# EasyEDA Pro project psu-5v-v101.eprj, schematic main-board
Board Name: main-board; Create Date: 2025-11-11; Page Name: P1; Project Name: psu-5v-v101; Schematic Name: main-board; Update Date: 2025-11-25; Company: EasyEDA.com; Page Size: A4; Version: V1.0
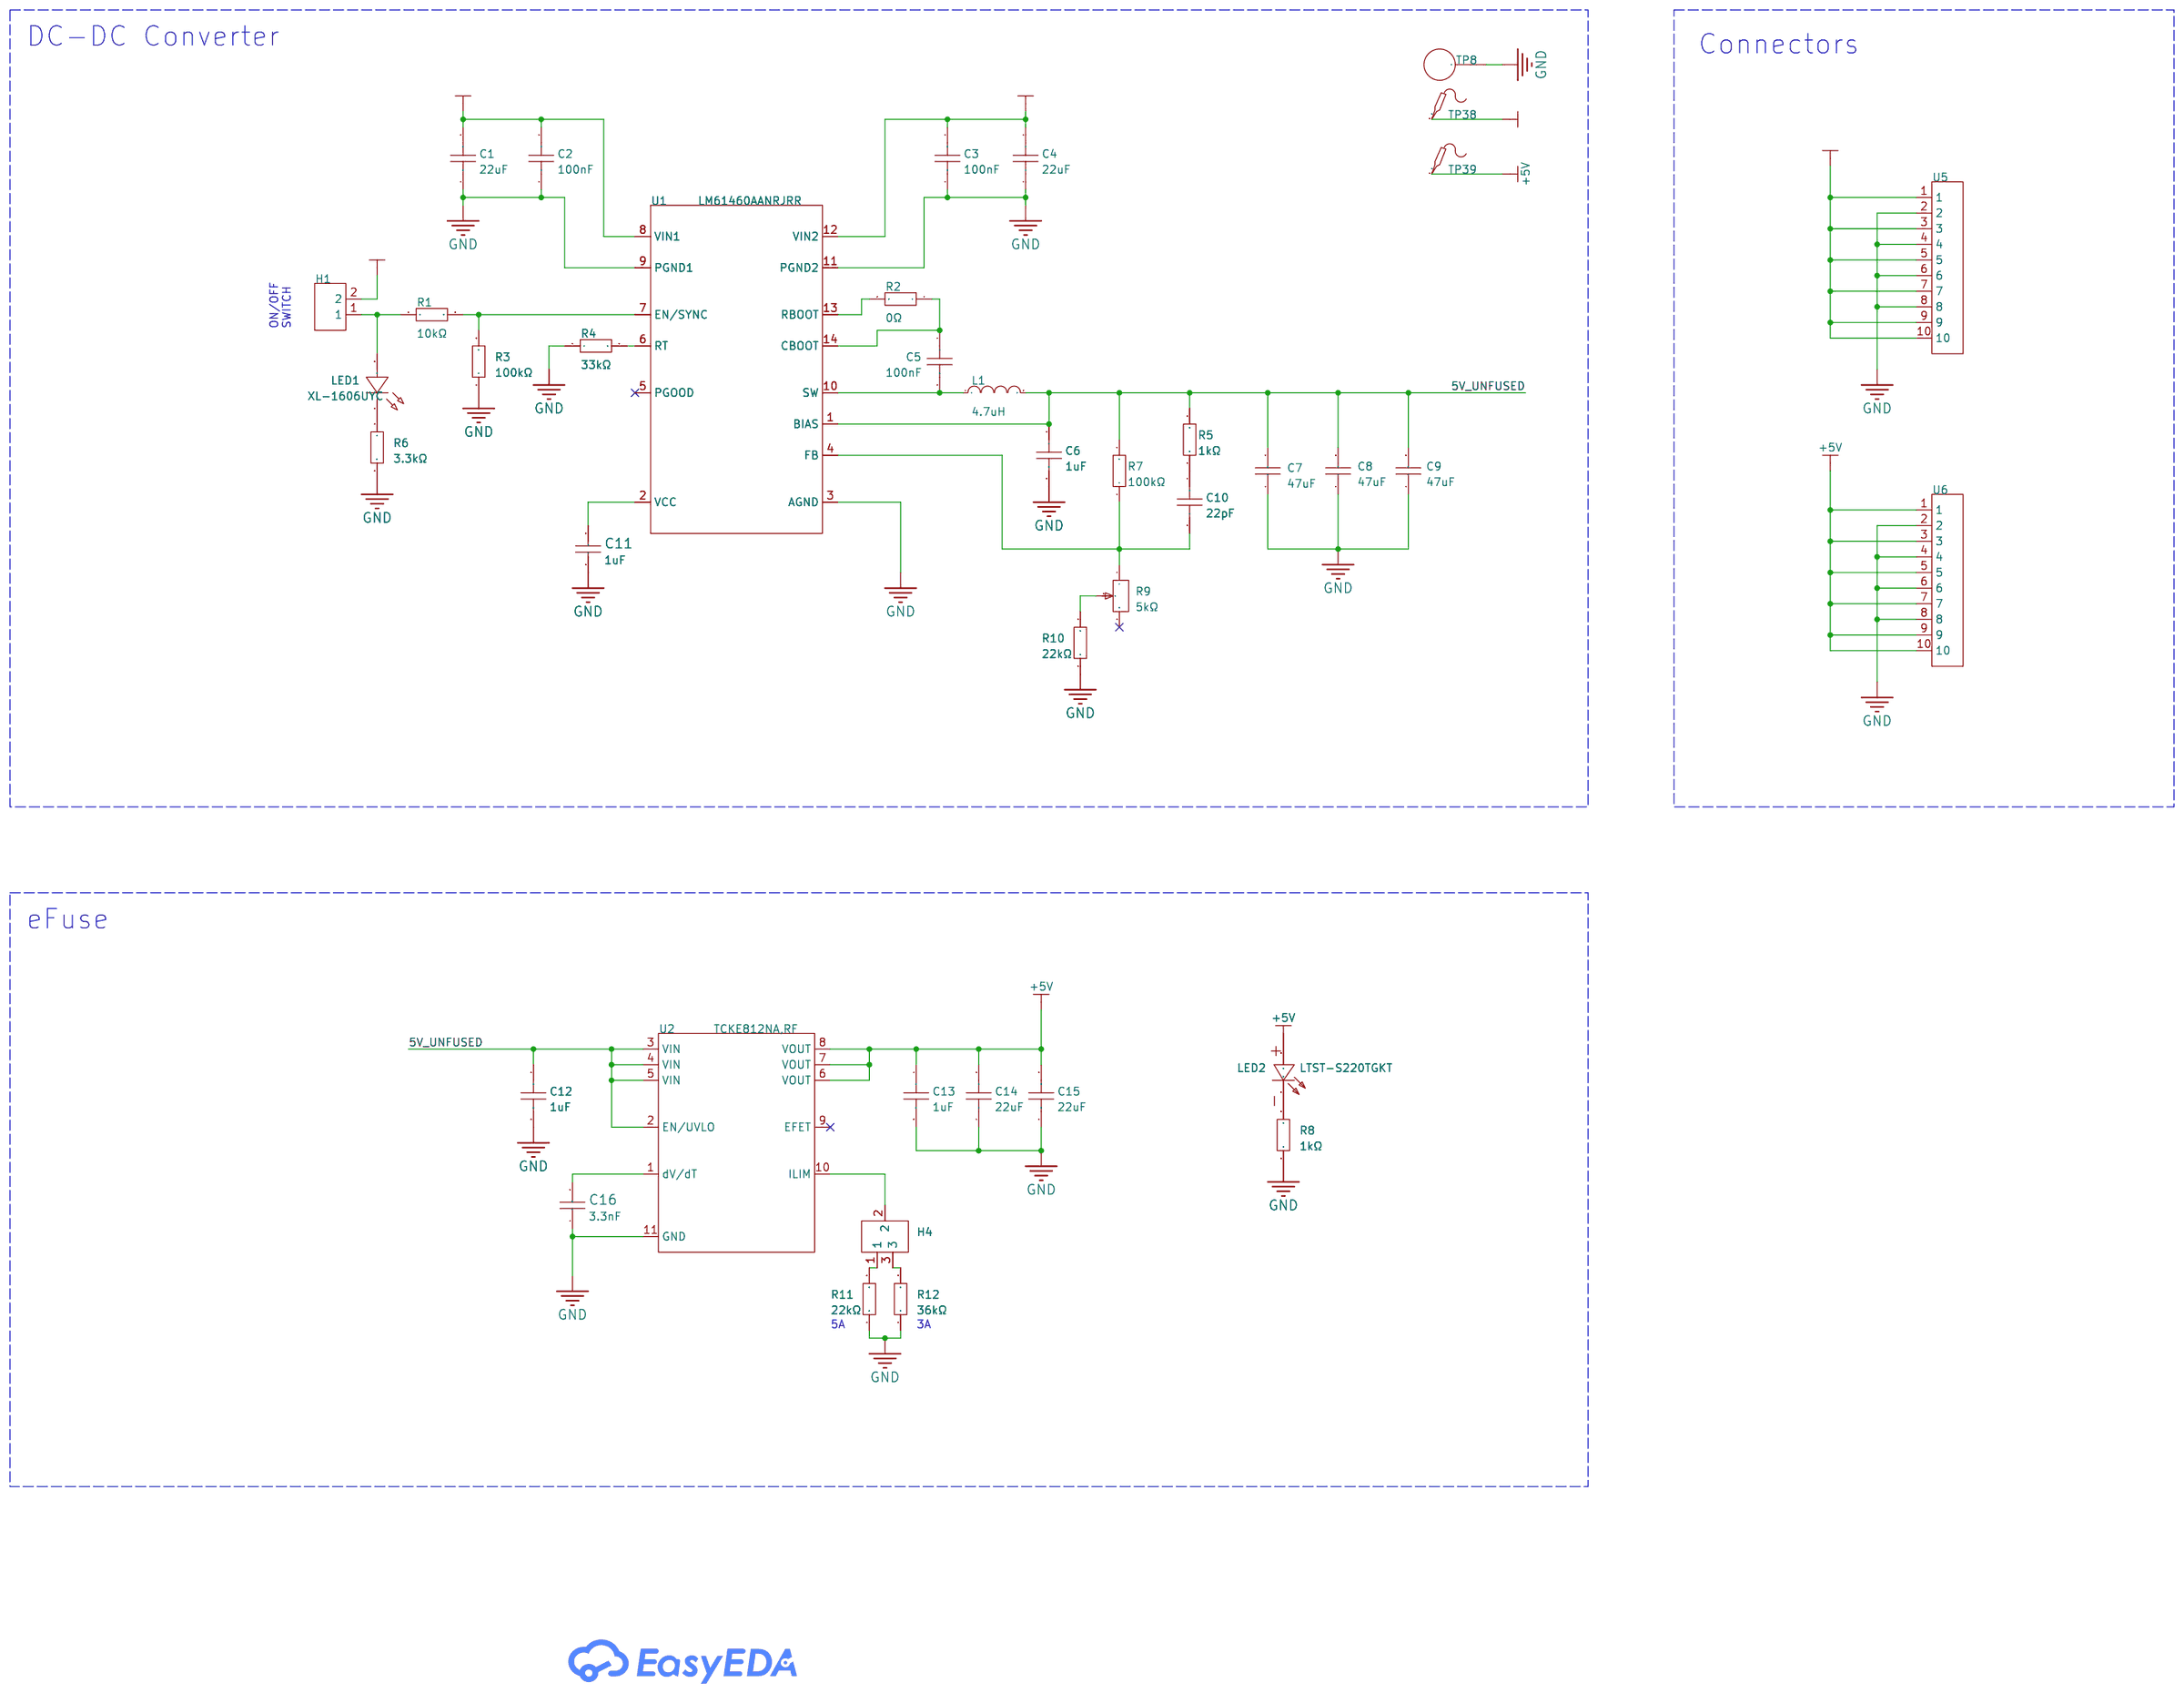
[diagram p2: schematic sheet]

## Parts
C1  22uF  [C2220]
C2  100nF  [C0603]
C3  100nF  [C0603]
C4  22uF  [C2220]
C5  100nF  [C0603]
C6  1uF  [C0805]
C7  47uF  [C1210]
C8  47uF  [C1210]
C9  47uF  [C1210]
C10  22pF  [C0603]
C11  1uF  [C0805]
C12  1uF  [C0805]
C13  1uF  [C0805]
C14  22uF  [C1206]
C15  22uF  [C1206]
C16  3.3nF  [C0603]
H1  PZ254V-11-02P  [HDR-TH_2P-P2.54-V-M]
H4  X6511WVS-03H-C60D48R2  [HDR-SMD_3P-P2.54_XKB_X6511WVS-03H-C60D48R2]
L1  4.7uH  [IND-SMD_L10.9-W10.0]
LED1  XL-1606UYC  [LED-SMD_L1.7-W1.1-RD_27-21]
LED2  LTST-S220TGKT  [LED-SMD_L2.2-W0.6-RD_GREEN]
R1  10kΩ  [R0603]
R2  0Ω  [R0603]
R3  100kΩ  [R0603]
R4  33kΩ  [R0603]
R5  1kΩ  [R0603]
R6  3.3kΩ  [R0603]
R7  100kΩ  [R0603]
R8  1kΩ  [R0603]
R9  5kΩ  [RES-ADJ-TH_3P-L6.6-W7.0-P2.54-L_3362P]
R10  22kΩ  [R0603]
R11  22kΩ  [R0603]
R12  36kΩ  [R0603]
TP8  RH-5004  [TESTPOINT_TH_BD2.5-D1.2]
TP38  -  [Test-Point-0.5mm]
TP39  -  [Test-Point-0.5mm]
U1  LM61460AANRJRR  [VQFN-HR-14_L4.0-W3.5-P0.50-TL_TI_RJR-1]
U2  TCKE812NA,RF  [VSON-10_L3.0-W3.0-P0.50-TL-EP]
U5  2541WR-10P  [HDR-TH_10P-P2.54-H-M-W10.4]
U6  2541WR-10P  [HDR-TH_10P-P2.54-H-M-W10.4]

## Library data of the parts
C1 C4 = FS55X226K500EHG: LCSC Part Name: 22uF ±10% 50V; Supplier Part: C784103; Manufacturer: PSA(信昌电陶); Supplier Footprint: 2220; JLCPCB Part Class: Extended Part; Datasheet: https://atta.szlcsc.com/upload/public/pdf/source/20190723/C381466_B1CCDB289216E7EE775C98769E222CFD.pdf; Supplier: LCSC; Tolerance: ±10%; Voltage Rating: 50V; Temperature Coefficient: X7R
C2 C3 C5 = CC0603KRX7R9BB104: Capacitance:100nF Tolerance:±10% Tolerance:±10% Voltage Rating:50V Temperature Coefficient:X7R; LCSC Part Name: 100nF ±10% 50V; Supplier Part: C14663; Manufacturer: YAGEO(国巨); Supplier Footprint: 0603; JLCPCB Part Class: Basic Part; Datasheet: https://item.szlcsc.com/datasheet/CC0603KRX7R9BB104/15331.html; Supplier: LCSC; Tolerance: ±10%; Voltage Rating: 50V; Temperature Coefficient: X7R
C6 C12 C13 = CL21B105KBFNNNE: Capacitance:1uF Tolerance:±10% Tolerance:±10% Voltage Rating:50V Temperature Coefficient:X7R; LCSC Part Name: 1uF ±10% 50V; Supplier Part: C28323; Manufacturer: SAMSUNG(三星); Supplier Footprint: 0805; JLCPCB Part Class: Basic Part; Datasheet: https://item.szlcsc.com/datasheet/CL21B105KBFNNNE/29074.html; Supplier: LCSC; Tolerance: ±10%; Voltage Rating: 50V; Temperature Coefficient: X7R
C7-C9 = GRM32ER71A476KE15L: LCSC Part Name: 47uF ±10% 10V; Supplier Part: C84494; Manufacturer: muRata(村田); Supplier Footprint: 1210; JLCPCB Part Class: Extended Part; Datasheet: https://atta.szlcsc.com/upload/public/pdf/source/20161226/1482720144456.pdf; Supplier: LCSC; Tolerance: ±10%
C10 = CL10C220JB8NNNC: Capacitance:22pF Tolerance:±5% Tolerance:±5% Voltage Rating:50V Temperature Coefficient:C0G; LCSC Part Name: 22pF ±5% 50V; Supplier Part: C1653; Manufacturer: SAMSUNG(三星); Supplier Footprint: 0603; JLCPCB Part Class: Basic Part; Datasheet: https://item.szlcsc.com/datasheet/CL10C220JB8NNNC/2005.html; Supplier: LCSC; Tolerance: ±5%; Voltage Rating: 50V; Temperature Coefficient: C0G
C11 = CL21B105KBFNNNE: LCSC Part Name: 1uF ±10% 50V; Supplier Part: C28323; Manufacturer: SAMSUNG(三星); Supplier Footprint: 0805; JLCPCB Part Class: Basic Part; Datasheet: https://item.szlcsc.com/datasheet/CL21B105KBFNNNE/29074.html; Supplier: LCSC; Tolerance: ±10%; Voltage Rating: 50V; Temperature Coefficient: X7R
C14 C15 = CL31B226KPHNNNE: LCSC Part Name: 22uF ±10% 10V; Supplier Part: C87996; Manufacturer: SAMSUNG(三星); Supplier Footprint: 1206; JLCPCB Part Class: Extended Part; Datasheet: https://item.szlcsc.com/datasheet/CL31B226KPHNNNE/89174.html; Supplier: LCSC; Tolerance: ±10%; Voltage Rating: 10V; Temperature Coefficient: X7R
C16 = CL10B332KB8NNNC: LCSC Part Name: 3.3nF ±10% 50V; Supplier Part: C1613; Manufacturer: SAMSUNG(三星); Supplier Footprint: 0603; JLCPCB Part Class: Basic Part; Datasheet: https://item.szlcsc.com/datasheet/CL10B332KB8NNNC/1965.html; Supplier: LCSC; Tolerance: ±10%; Voltage Rating: 50V; Temperature Coefficient: X7R
H1 = PZ254V-11-02P: LCSC Part Name: 1x2P 间距:2.54mm 方针 直插; Supplier Part: C492401; Manufacturer: XFCN(兴飞); Supplier Footprint: 插件,P=2.54mm; JLCPCB Part Class: Extended Part; Datasheet: https://item.szlcsc.com/datasheet/PZ254V-11-02P/502957.html; Supplier: LCSC; Pin Structure: 1x2P; Pitch: 2.54mm; Circluar Pins/Square Pins: Pin Header; Mounting Type: Through Hole; Number of Rows: 1; Number of Pins: 2P; Length of Mating Pin: 6mm; Insulation Height: 2.5mm; Length of End Connection Pin: 3mm; Contact Material: Brass; Operating Temperature: -40℃~+105℃; Color: Black
H4 = X6511WVS-03H-C60D48R2: Pin Structure:1x3P Pitch:2.54mm Row Spacing:2.54mm Circluar Pins/Square Pins:Policy Number of Rows:Single Row Number of Pins:3P Current Rating:3A Voltage Rating (Max):250V Length of Mating Pin:- Insulation Height:2.5mm Length of End Connection Pin:- Conta; LCSC Part Name: 1x3P 间距:2.54mm 方针; Supplier Part: C2883760; Manufacturer: XKB Connection(中国星坤); Supplier Footprint: SMD,P=2.54mm; JLCPCB Part Class: Extended Part; Datasheet: https://atta.szlcsc.com/upload/public/pdf/source/20200909/C780060_F941EB1B69F43B5D6329EAF74E2E27BB.pdf; Supplier: LCSC; Pin Structure: 1x3P; Pitch: 2.54mm; Row Spacing: 2.54mm; Circluar Pins/Square Pins: Policy; Number of Rows: Single Row; Number of Pins: 3P; Current Rating: 3A; Voltage Rating (Max): 250V; Insulation Height: 2.5mm; Contact Material: Brass; Contact Plating: Gold; Operating Temperature: -40℃~+105℃; Color: Black
L1 = ETQP6M4R7YLC: LCSC Part Name: 4.7uH ±20%; Supplier Part: C409643; Manufacturer: PANASONIC(松下); Supplier Footprint: SMD,10.9x10mm; JLCPCB Part Class: Extended Part; Datasheet: https://atta.szlcsc.com/upload/public/pdf/source/20190806/C409643_EEE3F0D2849D06837D605D0504463401.pdf; Supplier: LCSC; Tolerance: ±20%; Current Rating: 11.8A; DC Resistance(DCR): 8.7mΩ; Type: Molded Inductor; Ratings: AEC-Q200
LED1 = XL-1606UYC: LCSC Part Name: 0602黄色贴片式发光二极管; Supplier Part: C965862; Manufacturer: XINGLIGHT(成兴光); Supplier Footprint: SMD,1.7x1.1mm; JLCPCB Part Class: Extended Part; Datasheet: https://item.szlcsc.com/datasheet/XL-1606UYC/1051471.html; Supplier: LCSC; Illumination Color: Yellow; Voltage - Forward(Vf): 2.4V; Power(Watts): 50mW; Forward Current: 20mA; Wavelength - Dominant: 585nm~595nm; Peak Wavelength: 588nm; Lens Color: Water Clear; Luminous Intensity: 800mcd; Viewing Angle: 120°; Mounting Style: Side View Mount
LED2 = LTST-S220TGKT: LCSC Part Name: 普绿/黄绿 侧贴; Supplier Part: C160470; Manufacturer: LITEON(光宝); Supplier Footprint: SMD,1x2.2mm; JLCPCB Part Class: Extended Part; Datasheet: https://item.szlcsc.com/datasheet/LTST-S220TGKT/171850.html; Supplier: LCSC; Illumination Color: Yellow Green; Voltage - Forward(Vf): 3.2V; Power(Watts): 76mW; Forward Current: 20mA; Wavelength - Dominant: 525nm; Peak Wavelength: 530nm; Lens Color: Water Clear; Luminous Intensity: 260.5mcd; Viewing Angle: 130°; Mounting Style: Side View Mount; Operating Temperature: -20℃~+80℃
R1 = 0603WAF1002T5E: Type:Thick Film Resistor Resistance:10kΩ Tolerance:±1% Tolerance:±1% Power(Watts):100mW Voltage-Supply(Max):75V Temperature Coefficient:±100ppm/℃ Temperature Coefficient:±100ppm/℃ Operating Temperature:-55℃~+155℃ Operating Temperature:-55℃~+155℃; LCSC Part Name: 厚膜电阻 10kΩ ±1% 100mW; Supplier Part: C25804; Manufacturer: UNI-ROYAL(厚声); Supplier Footprint: 0603; JLCPCB Part Class: Basic Part; Datasheet: https://item.szlcsc.com/datasheet/0603WAF1002T5E/26547.html; Supplier: LCSC; Type: Thick Film Resistor; Tolerance: ±1%; Power(Watts): 100mW; Voltage-Supply(Max): 75V; Temperature Coefficient: ±100ppm/℃; Operating Temperature: -55℃~+155℃
R2 = 0603WAF0000T5E: Type:Thick Film Resistor Resistance:0Ω Tolerance:±1% Tolerance:±1% Power(Watts):100mW Voltage-Supply(Max):75V Temperature Coefficient:- Temperature Coefficient:- Operating Temperature:-55℃~+155℃ Operating Temperature:-55℃~+155℃; LCSC Part Name: 0Ω ±1% 100mW 厚膜电阻; Supplier Part: C21189; Manufacturer: UNI-ROYAL(厚声); Supplier Footprint: 0603; JLCPCB Part Class: Basic Part; Datasheet: https://item.szlcsc.com/datasheet/0603WAF0000T5E/21903.html; Supplier: LCSC; Type: Thick Film Resistor; Tolerance: ±1%; Power(Watts): 100mW; Voltage-Supply(Max): 75V; Operating Temperature: -55℃~+155℃
R3 R7 = 0603WAF1003T5E: Type:Thick Film Resistor Resistance:100kΩ Tolerance:±1% Tolerance:±1% Power(Watts):100mW Voltage-Supply(Max):75V Temperature Coefficient:±100ppm/℃ Temperature Coefficient:±100ppm/℃ Operating Temperature:-55℃~+155℃ Operating Temperature:-55℃~+155℃; LCSC Part Name: 100kΩ ±1% 100mW 厚膜电阻; Supplier Part: C25803; Manufacturer: UNI-ROYAL(厚声); Supplier Footprint: 0603; JLCPCB Part Class: Basic Part; Datasheet: https://item.szlcsc.com/datasheet/0603WAF1003T5E/26546.html; Supplier: LCSC; Type: Thick Film Resistor; Tolerance: ±1%; Power(Watts): 100mW; Voltage-Supply(Max): 75V; Temperature Coefficient: ±100ppm/℃; Operating Temperature: -55℃~+155℃
R4 = 0603WAF3302T5E: Type:Thick Film Resistor Resistance:33kΩ Tolerance:±1% Tolerance:±1% Power(Watts):100mW Voltage-Supply(Max):75V Temperature Coefficient:±100ppm/℃ Temperature Coefficient:±100ppm/℃ Operating Temperature:-55℃~+155℃ Operating Temperature:-55℃~+155℃; LCSC Part Name: 33kΩ ±1% 100mW 厚膜电阻; Supplier Part: C4216; Manufacturer: UNI-ROYAL(厚声); Supplier Footprint: 0603; JLCPCB Part Class: Basic Part; Datasheet: https://item.szlcsc.com/datasheet/0603WAF3302T5E/4623.html; Supplier: LCSC; Type: Thick Film Resistor; Tolerance: ±1%; Power(Watts): 100mW; Voltage-Supply(Max): 75V; Temperature Coefficient: ±100ppm/℃; Operating Temperature: -55℃~+155℃
R5 R8 = 0603WAF1001T5E: Type:Thick Film Resistors Resistance:1kΩ Tolerance:±1% Tolerance:±1% Power(Watts): Overload Voltage (Max): Temperature Coefficient:±100ppm/℃ Temperature Coefficient:±100ppm/℃ Operating Temperature Range:-55℃~+155℃ Operating Temperature Range:-55℃~+155℃; LCSC Part Name: 1kΩ ±1% 100mW 厚膜电阻; Supplier Part: C21190; Manufacturer: UNI-ROYAL(厚声); Supplier Footprint: 0603; JLCPCB Part Class: Basic Part; Datasheet: https://atta.szlcsc.com/upload/public/pdf/source/20200306/C422600_1E6D84923E4A46A82E41ADD87F860B5C.pdf; Supplier: LCSC; Type: Thick Film Resistors; Tolerance: ±1%; Temperature Coefficient: ±100ppm/℃; Operating Temperature Range: -55℃~+155℃
R6 = 0603WAF3301T5E: Type:Thick Film Resistor Resistance:3.3kΩ Tolerance:±1% Tolerance:±1% Power(Watts):100mW Voltage-Supply(Max):75V Temperature Coefficient:±100ppm/℃ Temperature Coefficient:±100ppm/℃ Operating Temperature:-55℃~+155℃ Operating Temperature:-55℃~+155℃; LCSC Part Name: 3.3kΩ ±1% 100mW 厚膜电阻; Supplier Part: C22978; Manufacturer: UNI-ROYAL(厚声); Supplier Footprint: 0603; JLCPCB Part Class: Basic Part; Datasheet: https://item.szlcsc.com/datasheet/0603WAF3301T5E/23705.html; Supplier: LCSC; Type: Thick Film Resistor; Tolerance: ±1%; Power(Watts): 100mW; Voltage-Supply(Max): 75V; Temperature Coefficient: ±100ppm/℃; Operating Temperature: -55℃~+155℃
R9 = 3362P-1-502LF: LCSC Part Name: 5kΩ ±10%; Supplier Part: C81260; Manufacturer: BOURNS; Supplier Footprint: 插件-3P,7x6.6mm; JLCPCB Part Class: Extended Part; Datasheet: https://item.szlcsc.com/datasheet/3362P-1-502LF/82410.html; Supplier: LCSC; Tolerance: ±10%; Power(Watts): 500mW; Temperature Coefficient: ±100ppm/℃
R10 R11 = 0603WAF2202T5E: Type:Thick Film Resistor Resistance:22kΩ Tolerance:±1% Tolerance:±1% Power(Watts):100mW Voltage-Supply(Max):75V Temperature Coefficient:±100ppm/℃ Temperature Coefficient:±100ppm/℃ Operating Temperature:-55℃~+155℃ Operating Temperature:-55℃~+155℃; LCSC Part Name: 22kΩ ±1% 100mW 厚膜电阻; Supplier Part: C31850; Manufacturer: UNI-ROYAL(厚声); Supplier Footprint: 0603; JLCPCB Part Class: Basic Part; Datasheet: https://atta.szlcsc.com/upload/public/pdf/source/20200306/C422600_1E6D84923E4A46A82E41ADD87F860B5C.pdf; Supplier: LCSC; Type: Thick Film Resistors; Tolerance: ±1%; Power(Watts): 100mW; Temperature Coefficient: ±100ppm/℃; Operating Temperature Range: -55℃~+155℃; Voltage-Supply(Max): 75V; Operating Temperature: -55℃~+155℃
R12 = FRC0603F3602TS: Type:Thick Film Resistor Resistance:36kΩ Tolerance:±1% Tolerance:±1% Power(Watts):100mW Voltage-Supply(Max):75V Temperature Coefficient:±100ppm/℃ Temperature Coefficient:±100ppm/℃ Operating Temperature:-55℃~+155℃ Operating Temperature:-55℃~+155℃; LCSC Part Name: 36kΩ ±1% 100mW 厚膜电阻; Supplier Part: C2930097; Manufacturer: FOJAN(富捷); Supplier Footprint: 0603; JLCPCB Part Class: Extended Part; Supplier: LCSC; Type: Thick Film Resistor; Tolerance: ±1%; Power(Watts): 100mW; Voltage-Supply(Max): 75V; Temperature Coefficient: ±100ppm/℃; Operating Temperature: -55℃~+155℃
TP8 = RH-5004: Connector Type:Pin type (through board) Plastic Color:Yellow Board Space (Diameter φ/ Length x Width):2.5mm; LCSC Part Name: PCB电路板测试点/测试针; Supplier Part: C5199804; Manufacturer: 荣和; JLCPCB Part Class: Extended Part; Supplier: LCSC; Connector Type: Pin type (through board); Plastic Color: Yellow; Board Space (Diameter φ/ Length x Width): 2.5mm
TP38 TP39 = Test-Point
U1 = LM61460AANRJRR: LCSC Part Name: 3V至36V、6A低EMI同步降压转换器; Supplier Part: C2864505; Manufacturer: TI(德州仪器); Supplier Footprint: VQFN-14-HR(3.5x4); JLCPCB Part Class: Extended Part; Datasheet: https://www.ti.com/cn/lit/gpn/lm61460; Supplier: LCSC; Function: Step-down type; Output Type: Adjustable; Input Voltage: 3V~36V; Output Current: 6A; Switching Frequency: 200kHz~2.2MHz; Operating Temperature: -40℃~+150℃; Synchronous Rectification: Yes; Number of Outputs: 1; Topology: Step-down; Switch tube (built-in/external): Built-in
U2 = TCKE812NA,RF: Voltage Rating:18V Voltage Rating:18V; Supplier Part: C1880271; Manufacturer: TOSHIBA(东芝); Supplier Footprint: VSON-10-EP(3x3); JLCPCB Part Class: Extended Part; Datasheet: https://item.szlcsc.com/datasheet/TCKE812NA%252CRF/1971090.html; Supplier: LCSC; Voltage Rating: 18V
U5 U6 = 2541WR-10P: LCSC Part Name: 1x10P 间距:2.54mm 方针 弯插; Supplier Part: C5383101; Manufacturer: HanElectricity(瀚源); Supplier Footprint: 弯插,P=2.54mm; JLCPCB Part Class: Extended Part; Datasheet: https://item.szlcsc.com/datasheet/2541WR-10P/6258461.html; Supplier: LCSC; Pin Structure: 1x10P; Pitch: 2.54mm; Circluar Pins/Square Pins: Pin Header; Mounting Type: Right Angle; Number of Rows: 1; Number of Pins: 10P; Current Rating: 3A; Length of Mating Pin: 6mm; Insulation Height: 2.54mm; Contact Material: Brass; Contact Plating: Gold; Operating Temperature: -40℃~+105℃; Color: Black

## Nets
5V_UNFUSED: C6.1 C7.2 C8.2 C9.2 C12.1 L1.2 R5.2 R7.2 U1.1(BIAS) U2.2(EN/UVLO) U2.3(VIN) U2.4(VIN) U2.5(VIN)
+5V: C13.1 C14.2 C15.2 LED2.2(A) TP39.1 U2.6(VOUT) U2.7(VOUT) U2.8(VOUT) U6.1 U6.3 U6.5 U6.7 U6.9 U6.10
+12V: C1.2 C2.2 C3.2 C4.2 H1.2 TP38.1 U1.8(VIN1) U1.12(VIN2) U5.1 U5.3 U5.5 U5.7 U5.9 U5.10
GND: C1.1 C2.1 C3.1 C4.1 C6.2 C7.1 C8.1 C9.1 C11.1 C12.2 C13.2 C14.1 C15.1 C16.1 R3.1 R4.1 R6.2 R8.2 R10.1 R11.1 R12.1 TP8.1 U1.3(AGND) U1.9(PGND1) U1.11(PGND2) U2.11(GND) U5.2 U5.4 U5.6 U5.8 U6.2 U6.4 U6.6 U6.8
$1N1787: R1.2 R3.2 U1.7(EN/SYNC)
$1N1788: R4.2 U1.6(RT)
$1N1790: C11.2 U1.2(VCC)
$1N1799: C5.1 R2.1 U1.14(CBOOT)
$1N1800: C5.2 L1.1 U1.10(SW)
$1N1801: R2.2 U1.13(RBOOT)
$1N1803: C10.1 R5.1
$1N1805: C10.2 R7.1 R9.1 U1.4(FB)
$1N1808: R9.2 R10.2
$1N1828: C16.2 U2.1(dV/dT)
$1N1836: H4.1 R11.2
$1N1838: H4.3 R12.2
$1N1840: H4.2 U2.10(ILIM)
$1N2829: LED1.1(K) R6.1
$1N2839: H1.1 LED1.2(A) R1.1
$1N2859: LED2.1(C) R8.1

Not connected (* = marked no-connect by the designer): R9 3*; U1 5(PGOOD)*; U2 9(EFET)*

## Notes on the sheet
- DC-DC Converter
- Connectors
- ON/OFF
  SWITCH
- eFuse
- 5A
- 3A
